# Altium schematic sheet Thermometers.SchDoc: RFSoC AMC
size 420 x 297 mm; CmpIndex: 52; CompanyName: WUT; DrawnBy: T. Przywozki; Organization: WUT ISE; Address1: Warsaw University of Technology; Address2: Nowowiejska 15/19 00-665 Warsaw; Address3: Tomasz.Przywozki@pw.edu.pl; DocumentNumber: 33; Revision: 1; SheetNumber: 33; SheetTotal: 45; Project: RFSoC AMC; ModifiedBy: T. Przywozki; CreateDate: -; CheckedDate: -; DivGrp: ISE; Designer: T. Przywozki; ModifiedDate: -; ProjectName: ADC/DAC MEZZANINE
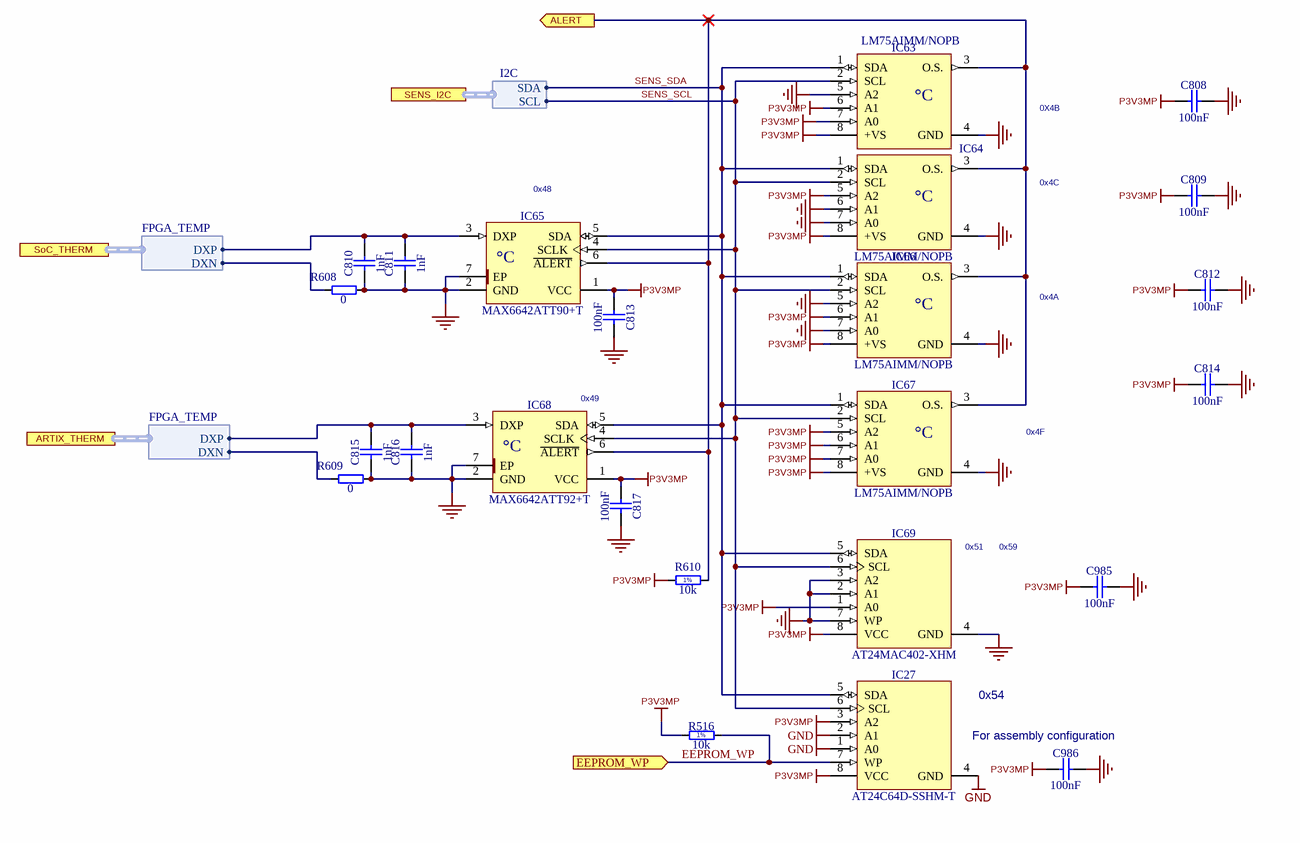
[diagram p0: Thermometers.SchDoc]

## Parts
C808  100nF  [CAPC0603X33N]
C809  100nF  [CAPC0603X33N]
C810  1nF  [CAPC1005X55N]
C811  1nF  [CAPC1005X55N]
C812  100nF  [CAPC0603X33N]
C813  100nF  [CAPC0603X33N]
C814  100nF  [CAPC0603X33N]
C815  1nF  [CAPC1005X55N]
C816  1nF  [CAPC1005X55N]
C817  100nF  [CAPC0603X33N]
C985  100nF  [CAPC0603X33N]
C986  100nF  [CAPC0603X33N]
IC27  AT24C64D-SSHM-T  [SOIC127P600X175-8N]
IC63  LM75AIMM/NOPB  [SOP65P490X109-8N]
IC64  LM75AIMM/NOPB  [SOP65P490X109-8N]
IC65  MAX6642ATT90+T  [SON95P300X300X80-7N-R160X240]
IC66  LM75AIMM/NOPB  [SOP65P490X109-8N]
IC67  LM75AIMM/NOPB  [SOP65P490X109-8N]
IC68  MAX6642ATT92+T  [SON95P300X300X80-7N-R160X240]
IC69  AT24MAC402-XHM  [SOP65P640X120-8N]
R516  10k  [RESC1005X40N]
R608  0  [RESC1005X40N]
R609  0  [RESC1005X40N]
R610  10k  [RESC1005X40N]

## Ports
ALERT (out), ARTIX_THERM (harness FPGA_TEMP), EEPROM_WP (in), SENS_I2C (harness I2C), SoC_THERM (harness FPGA_TEMP)

## Harnesses
I2C: SDA, SCL
FPGA_TEMP: DXP, DXN

## Nets
GND: C808.2 C809.2 C810.1 C811.1 C812.2 C813.1 C814.2 C815.1 C816.1 C817.1 C985.2 C986.2 IC27.1(A0) IC27.2(A1) IC27.4(GND) IC63.4(GND) IC63.5(A2) IC64.4(GND) IC64.6(A1) IC64.7(A0) IC65.2(GND) IC65.7(EP) IC66.4(GND) IC66.5(A2) IC66.7(A0) IC67.4(GND) IC68.2(GND) IC68.7(EP) IC69.2(A1) IC69.3(A2) IC69.4(GND) IC69.7(WP) R608.2 R609.2
P3V3MP: C808.1 C809.1 C812.1 C813.2 C814.1 C817.2 C985.1 C986.1 IC27.3(A2) IC27.8(VCC) IC63.6(A1) IC63.7(A0) IC63.8(+VS) IC64.5(A2) IC64.8(+VS) IC65.1(VCC) IC66.6(A1) IC66.8(+VS) IC67.5(A2) IC67.6(A1) IC67.7(A0) IC67.8(+VS) IC68.1(VCC) IC69.1(A0) IC69.8(VCC) R516.1 R610.1
ALERT: IC63.3(O.S.) IC64.3(O.S.) IC65.6(~{ALERT}) IC66.3(O.S.) IC67.3(O.S.) IC68.6(~{ALERT}) R610.2 ; port ALERT
EEPROM_WP: IC27.7(WP) R516.2 ; port EEPROM_WP
SENS_SCL: IC27.6(SCL) IC63.2(SCL) IC64.2(SCL) IC65.4(SCLK) IC66.2(SCL) IC67.2(SCL) IC68.4(SCLK) IC69.6(SCL) ; port SENS_I2C.SCL
SENS_SDA: IC27.5(SDA) IC63.1(SDA) IC64.1(SDA) IC65.5(SDA) IC66.1(SDA) IC67.1(SDA) IC68.5(SDA) IC69.5(SDA) ; port SENS_I2C.SDA
NetC810_2: C810.2 C811.2 IC65.3(DXP) ; port SoC_THERM.DXP
NetC815_2: C815.2 C816.2 IC68.3(DXP) ; port ARTIX_THERM.DXP
NetR608_1: R608.1 ; port SoC_THERM.DXN
NetR609_1: R609.1 ; port ARTIX_THERM.DXN

## Notes on the sheet
- 0X4B
- (near IC65) 0x48
- 0x4C
- 0x4A
- (near IC68) 0x49
- 0x4F
- (near IC69) 0x51
- (near IC69) 0x59
- (near IC27) 0x54
- For assembly configuration
- Project/Equipment
- Document
- Designer
- Drawn by
- Check.by
- Copyright WUT ISE 2021
  This documentation describes Open Hardware and is licensed under CERN OHL v.1.1. You may redistribute and modify this documentaction under the terms of the CERN OHL v1.1.
  (http://ohwr.org/CERNOHL). This documentation is dristributed WITHOUT ANY EXPRESS OR IMPLIED WARRANTY, INCLUDING OF MERCHANTABLITY, SATISFACTORY QUALITY AND FITNESS FOR A PARTICULAR PURPOSE. Please see the CERN OHL v.1.1 for applicable conditions
- File
- Last Mod.
- Print Date
- Sheet
- Size
- A3
- of
- Rev
- Contact:
- (in symbol LM75AIMM/NOPB) °C
- (in symbol MAX6642ATT90+T) °C
- (in symbol MAX6642ATT92+T) °C
- (in symbol R0402_10K_1%_0.0625W_100PPM) 1%

## Library data of the parts
C808 C809 C812-C814 C817 C985 C986 = CC0201_100NF_6.3V_10%_X5R: Non-polarised capacitor; Manufacturer: GENERIC; Part Description: SMD Multilayer Chip Ceramic Capacitor; Manufacturer1 Part Number: 02016D104KAT2A; Tolerance: ±10%; Voltage: 6.3V; TC: X5R; Manufacturer Part Number: CC0201_100NF_6.3V_10%_X5R; Part Number: CC0201_100NF_6.3V_10%_X5R; Value: 100nF; Component Kind: Standard; Component Type: Standard; Pin Count: 2; Status: Not Recommended; Case: 0201; Mounted: Yes; Socket: No; SMD: Yes; Sense: No; Manufacturer1 Example: AVX; Manufacturer1 ComponentHeight: 0.33mm; HelpURL: \\cern.ch\dfs\Applications\Altium\Datasheets\CC0201_X5R_AVX.pdf; Author: CERN DEM JLC; CreateDate: 03/12/2007; LatestRevisionDate: 03/12/2007
C810 C811 C815 C816 = CC0402_1NF_50V_10%_X7R: Non-polarised capacitor; Manufacturer: GENERIC; Part Description: SMD Multilayer Chip Ceramic Capacitor; Manufacturer1 Part Number: 223858715623; Tolerance: ±10%; Voltage: 50V; TC: X7R; Manufacturer Part Number: CC0402_1NF_50V_10%_X7R; Part Number: CC0402_1NF_50V_10%_X7R; Value: 1nF; Component Kind: Standard; Component Type: Standard; Pin Count: 2; Status: Not Recommended; Case: 0402; Mounted: Yes; Socket: No; SMD: Yes; Sense: No; Manufacturer1 Example: PHYCOMP; Manufacturer1 ComponentHeight: 0.55mm; HelpURL: \\cern.ch\dfs\Applications\Altium\Datasheets\CC0402_X7R_PHYCOMP.pdf; Author: CERN DEM JLC; CreateDate: 03/12/2007; LatestRevisionDate: 03/12/2007
IC27 = AT24C64D-SSHM-T: 64K (8192 x 8), I2C-Compatible (2-Wire) Serial EEPROM; Part Description: 1.7V to 5.5V, 64K (8192 x 8), I2C-Compatible (2-Wire) Serial EEPROM; Manufacturer: ATMEL; PressFit: No; Bonding: No; Part Number: AT24C64D-SSHM-T; Component Kind: Standard; Component Type: Standard; Device: AT24C64D-SSHM-T; PackageDescription: SOIC 8, Pitch 1.27mm - Body 4x5mm, IPC Medium Density; Manufacturer Part Number: AT24C64D-SSHM-T; Pin Count: 8; Case: SOIC8; Mounted: Yes; Socket: No; SMD: Yes; Sense: No; ComponentHeight: 1.75mm; HelpURL: \\cern.ch\dfs\Applications\Altium\Datasheets\AT24C64D-SSHM-T.pdf; Author: CERN DEM JLC; CreateDate: 26.11.2013; LatestRevisionDate: 30.04.2014
IC63 IC64 IC66 IC67 = LM75AIMM/NOPB: Digital Temperature Sensor and Thermal Watchdog with Two-Wire Interface; Manufacturer: TEXAS INSTRUMENTS; Part Description: -25° to +100°C ±2°C Digital Temperature Sensor and Thermal Watchdog with Two-Wire Interface; PressFit: No; Bonding: No; Manufacturer Part Number: LM75AIMM/NOPB; PackageDescription: SOP, 0.65mm pitch; 8 pin,3.00mm W X 3.00mm L X 1.09mm H bodyI, PC Medium Density; Part Number: LM75AIMM/NOPB; Component Kind: Standard; Component Type: Standard; Device: LM75AIMM/NOPB; Pin Count: 8; Case: SSOP8; Mounted: Yes; Socket: No; SMD: Yes; Sense: No; ComponentHeight: 1.09mm; HelpURL: \\cern.ch\dfs\Applications\Altium\Datasheets\LM75AIMM-NOPB.pdf; Author: CERN DEM JLC; CreateDate: 15/10/2012; LatestRevisionDate: 15/10/2012
IC65 = MAX6642ATT90+T: ±1°C, SMBus-Compatible Remote/Local Temperature Sensor with Overtemperature Alarm; Manufacturer: MAXIM; Part Description: 0°C to +125°C, ±1°C, SMBus-Compatible Remote/Local Temperature Sensor with Overtemperature Alarm (Address 1001 000); PressFit: No; Bonding: No; Manufacturer Part Number: MAX6642ATT90+T; PackageDescription: SON, 0.95mm Pitch; 6 Pin, 3.00mm W X 3mm L X 0.80mm H body (w/Thermal Tab 1.6mm x 2.4mm); Part Number: MAX6642ATT90+T; Component Kind: Standard; Component Type: Standard; Device: MAX6642ATT90+T; Pin Count: 7; Case: SON6; Mounted: Yes; Socket: No; SMD: Yes; Sense: No; ComponentHeight: 0.8mm; HelpURL: \\cern.ch\dfs\Applications\Altium\Datasheets\MAX6642ATT90+T.pdf; Author: CERN DEM JLC; CreateDate: 26/11/2013; LatestRevisionDate: 26/11/2013
IC68 = MAX6642ATT92+T: ±1°C, SMBus-Compatible Remote/Local Temperature Sensor with Overtemperature Alarm; Part Description: 0°C to +125°C, ±1°C, SMBus-Compatible Remote/Local Temperature Sensor with Overtemperature Alarm (Address 1001 001); Manufacturer: MAXIM; PressFit: No; Bonding: No; Part Number: MAX6642ATT92+T; Component Kind: Standard; Component Type: Standard; Device: MAX6642ATT92+T; PackageDescription: SON, 0.95mm Pitch; 6 Pin, 3.00mm W X 3mm L X 0.80mm H body (w/Thermal Tab 1.6mm x 2.4mm); Manufacturer Part Number: MAX6642ATT92+T; Pin Count: 7; Case: SON6; Mounted: Yes; Socket: No; SMD: Yes; Sense: No; ComponentHeight: 0.8mm; HelpURL: \\cern.ch\dfs\Applications\Altium\Datasheets\MAX6642ATT92+T.pdf; Author: CERN DEM JLC; CreateDate: 26.11.2013; LatestRevisionDate: 26.11.2013
IC69 = AT24MAC402-XHM: 1.7V to 5.5V, I2C-Compatible (2-wire) 2-Kbit (256 x 8) Serial EEPROM; Manufacturer: ATMEL; Part Description: 1.7V to 5.5V, I2C-Compatible (2-wire) 2-Kbit (256 x 8) Serial EEPROM with a EUI-48 Address; PressFit: No; Bonding: No; Footprint: SOP65X640X120-8N; Manufacturer Part Number: AT24MAC402-XHM; PackageDescription: SOP, 0.65mm pitch; 8 pin, 4.40mm W X 3.00mm L X 1.20mm H body, IPC Medium Density; Part Number: AT24MAC402-XHM; Component Kind: Standard; Component Type: Standard; Device: AT24MAC402-XHM; Pin Count: 8; Case: TSSOP8; Mounted: Yes; Socket: No; SMD: Yes; Sense: No; ComponentHeight: 1.2mm; HelpURL: \\cern.ch\dfs\Applications\Altium\Datasheets\AT24MAC402-XHM.pdf; Author: CERN DEM MR; CreateDate: 09/03/2016; LatestRevisionDate: 09/11/2016
R516 = R0402_10K_1%_0.0625W_100PPM: Resistor - 1%; Part Description: General Purpose Thick Film Chip Resistor; Manufacturer: GENERIC; Manufacturer1 Part Number: 232270671003L; TC: ±100ppm/°C; PressFit: No; Part Number: R0402_10K_1%_0.0625W_100PPM; Component Kind: Standard; Component Type: Standard; Pin Count: 2; Value: 10k; Status: Not Recommended; Power: 0.0625W; Tolerance: ±1%; Manufacturer Part Number: R0402_10K_1%_0.0625W_100PPM; Case: 0402; Mounted: Yes; Sense: No; Socket: No; SMD: Yes; Manufacturer1 Example: YAGEO PHYCOMP; Manufacturer1 ComponentHeight: 0.4mm; HelpURL: \\cern.ch\dfs\Applications\Altium\Datasheets\R0402_Phycomp_RC0402.pdf; Author: CERN DEM JLC; CreateDate: 03.12.2007; LatestRevisionDate: 17.10.2012
R608 R609 = R0402_0R_JUMPER: Resistor; Manufacturer: GENERIC; Part Description: 1A (0.05R Max DC Resistance) Zero Ohm Jumper; Manufacturer1 Part Number: 232270591001L; PressFit: No; Manufacturer Part Number: R0402_0R_JUMPER; Part Number: R0402_0R_JUMPER; Value: 0; Component Kind: Standard; Component Type: Standard; Pin Count: 2; Status: Not Recommended; Case: 0402; Mounted: Yes; Sense: No; Socket: No; SMD: Yes; Manufacturer1 Example: YAGEO PHYCOMP; Manufacturer1 ComponentHeight: 0.4mm; HelpURL: \\cern.ch\dfs\Applications\Altium\Datasheets\R0402_Phycomp_RC0402.pdf; Author: CERN DEM JLC; CreateDate: 03/12/2007; LatestRevisionDate: 17/10/2012
R610 = R0402_10K_1%_0.0625W_100PPM: Resistor - 1%; Manufacturer: GENERIC; Part Description: General Purpose Thick Film Chip Resistor; Manufacturer1 Part Number: 232270671003L; TC: ±100ppm/°C; PressFit: No; Manufacturer Part Number: R0402_10K_1%_0.0625W_100PPM; Part Number: R0402_10K_1%_0.0625W_100PPM; Tolerance: ±1%; Value: 10k; Component Kind: Standard; Component Type: Standard; Pin Count: 2; Status: Not Recommended; Power: 0.0625W; Case: 0402; Mounted: Yes; Sense: No; Socket: No; SMD: Yes; Manufacturer1 Example: YAGEO PHYCOMP; Manufacturer1 ComponentHeight: 0.4mm; HelpURL: \\cern.ch\dfs\Applications\Altium\Datasheets\R0402_Phycomp_RC0402.pdf; Author: CERN DEM JLC; CreateDate: 03/12/2007; LatestRevisionDate: 17/10/2012